# Altium project PCB_Project.PrjPcb
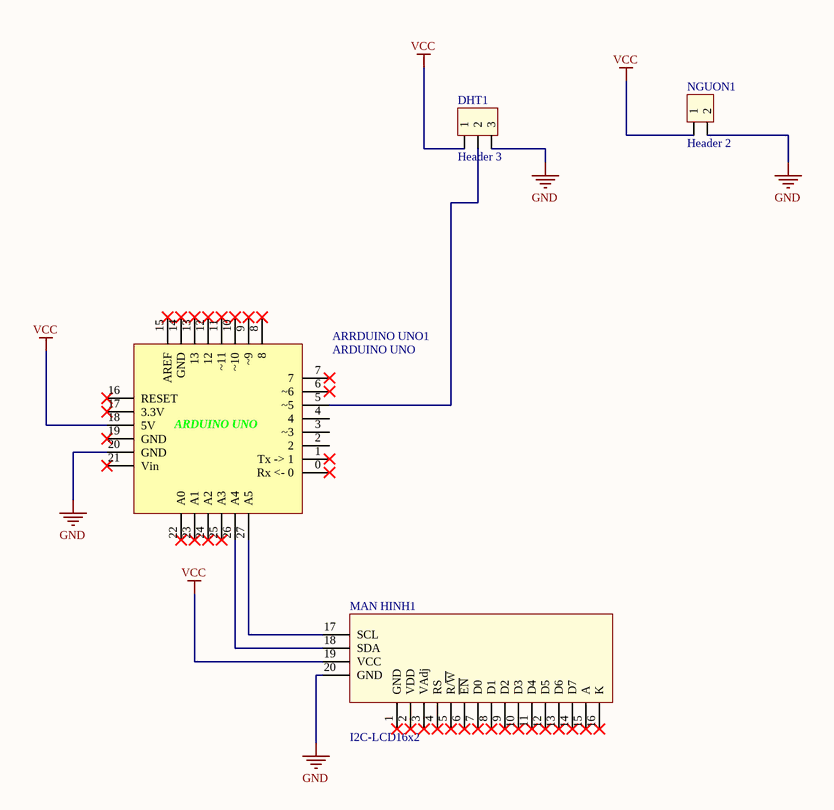
[diagram p0: Sheet1.SchDoc]
1 sheet, 4 parts. Net scope: global (net labels, ports and power ports of the same name join across sheets).
Board file: PCB1.PcbDoc

## Sheet Sheet1.SchDoc
size A4; SheetNumber: 1; SheetTotal: 1

### Parts
ARRDUINO_UNO1  ARDUINO UNO  [ARDUINO UNO]
DHT1  Header 3  [HED3]
MAN_HINH1  I2C-LCD16x2  [I2C-LCD16X2]
NGUON1  Header 2  [HED2]

### Nets
GND: ARRDUINO_UNO1.20(GND) DHT1.3 MAN_HINH1.20(GND) NGUON1.2
VCC: ARRDUINO_UNO1.18(5V) DHT1.1 MAN_HINH1.19(VCC) NGUON1.1
NetARRDUINO_UNO1_5: ARRDUINO_UNO1.5(~5) DHT1.2
NetARRDUINO_UNO1_26: ARRDUINO_UNO1.26(A4) MAN_HINH1.18(SDA)
NetARRDUINO_UNO1_27: ARRDUINO_UNO1.27(A5) MAN_HINH1.17(SCL)

Not connected (* = marked no-connect by the designer): ARRDUINO_UNO1 0(Rx_<-_0)* 1(Tx_->_1)* 2 3(~3) 4 6(~6)* 7* 8* 9(~9)* 10(~10)* 11(~11)* 12* 13* 14(GND)* 15(AREF)* 16(RESET)* 17(3.3V)* 19(GND)* 21(Vin)* 22(A0)* 23(A1)* 24(A2)* 25(A3)*; MAN_HINH1 1(GND)* 2(VDD)* 3(VAdj)* 4(RS)* 5(R/~{W})* 6(~{EN})* 7(D0)* 8(D1)* 9(D2)* 10(D3)* 11(D4)* 12(D5)* 13(D6)* 14(D7)* 15(A)* 16(K)*

### Library data of the parts
DHT1 = Hed3: Header 3 (Green); Value: Header 3
MAN_HINH1 = I2C-LCD16x2: LCD dipslay 16 char, 2 line; Value: LCD16x2A
NGUON1 = Header 2: Header 2 (Green); Value: Header 2